# EAGLE design csa_extender_v1.0a (EAGLE 6.4)
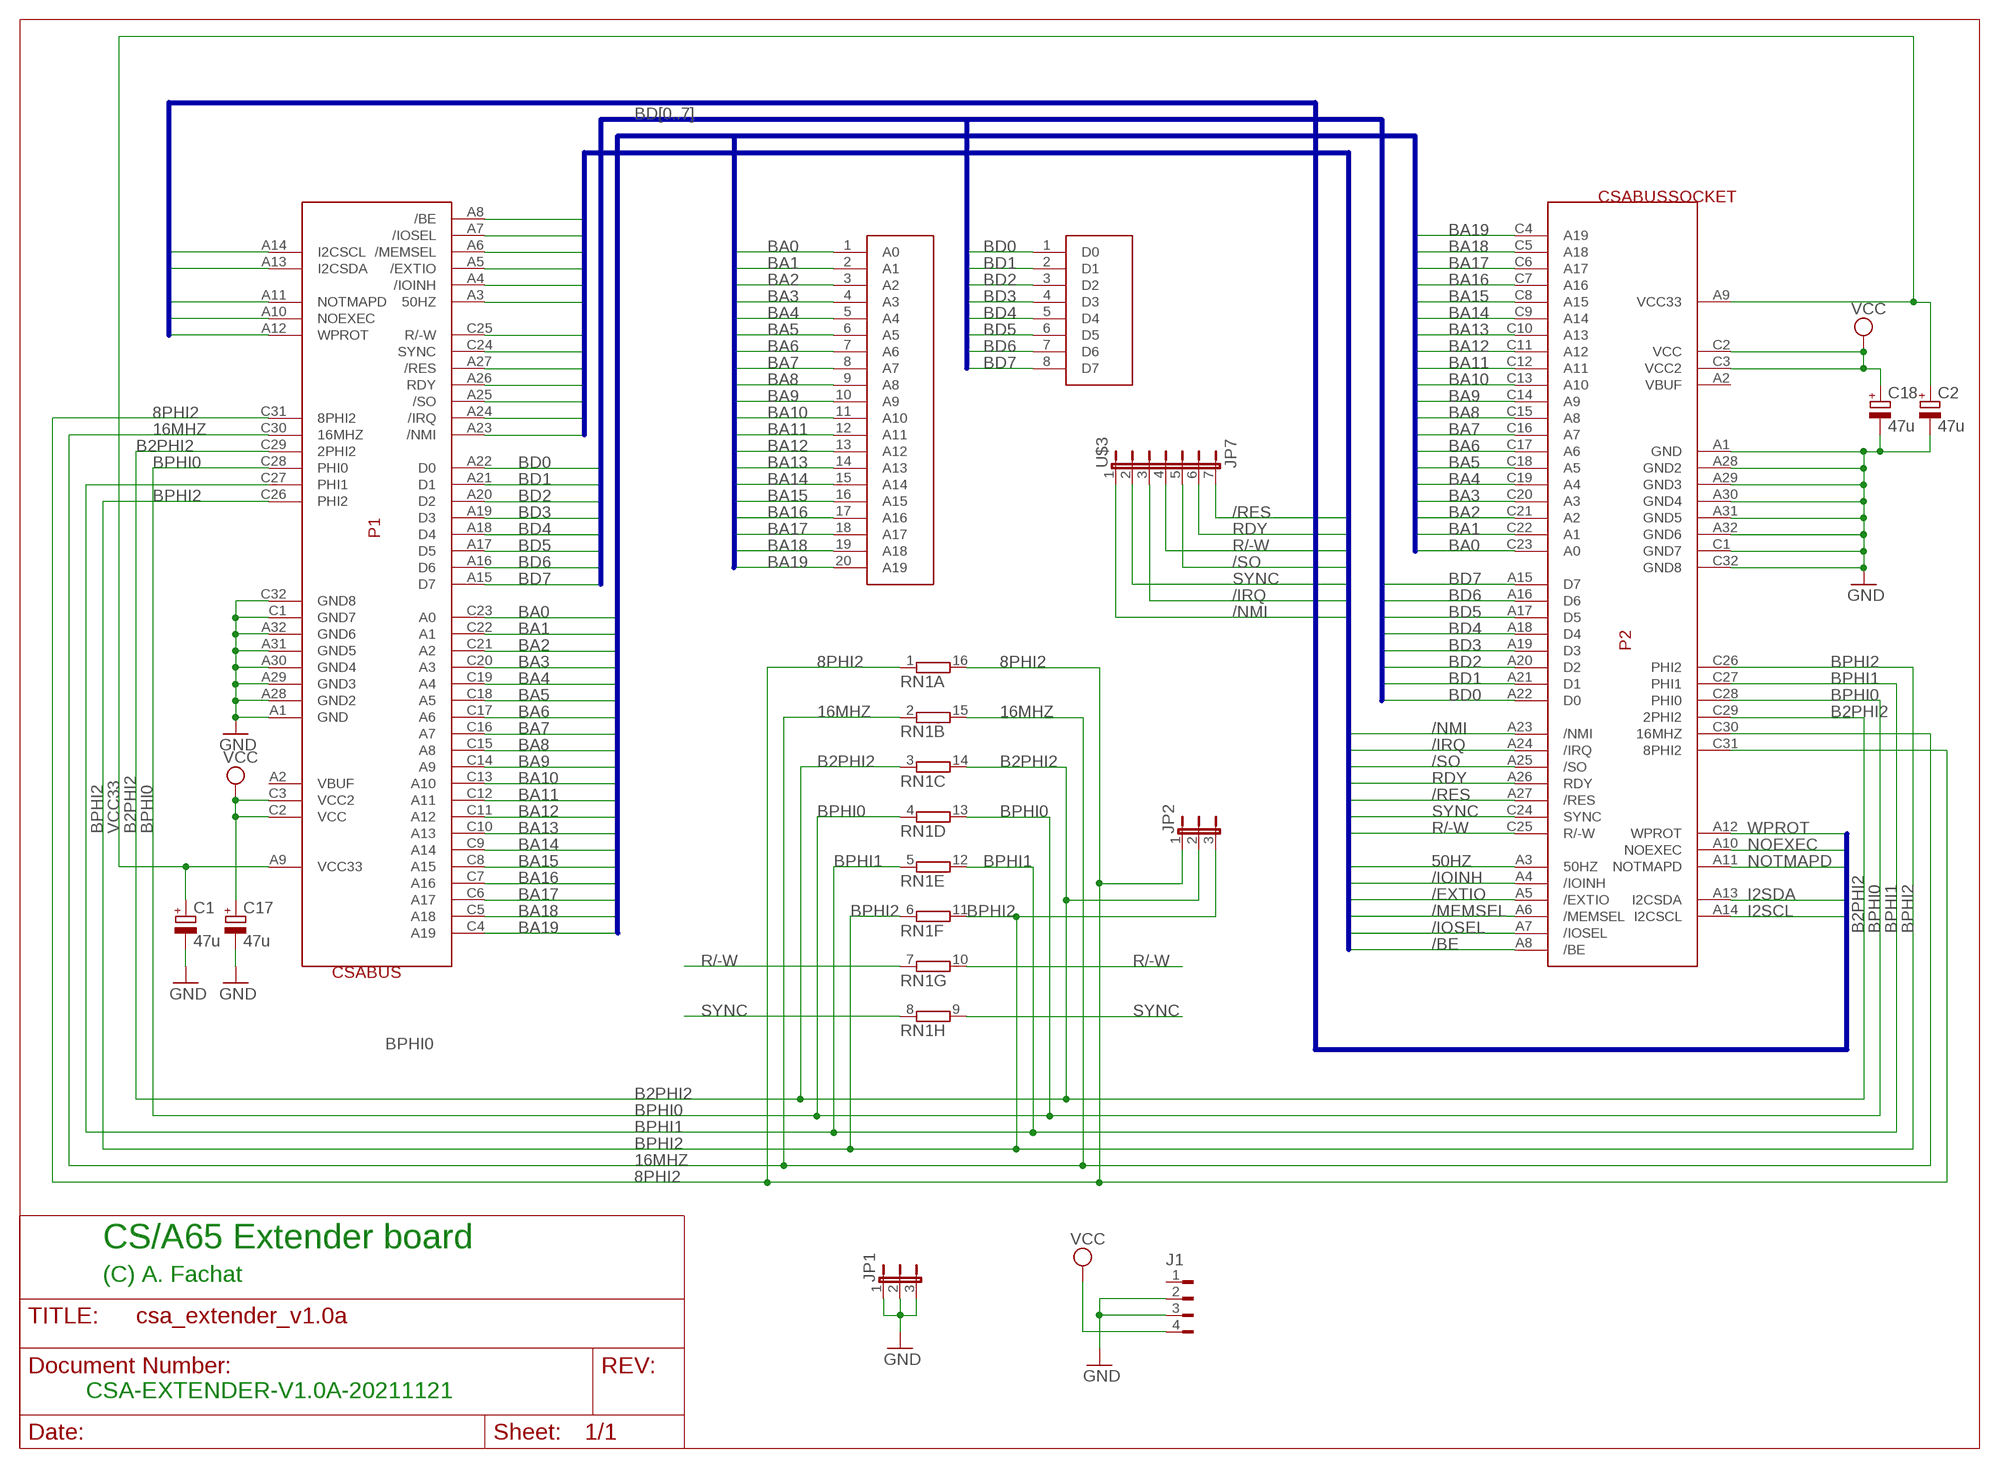
[diagram p0: schematic, sheet 1]

## Parts
C1  47u  CPOL-EUE2.5-5  [E2,5-5]
C2  47u  CPOL-EUE2.5-5  [E2,5-5]
C17  47u  CPOL-EUE2.5-5  [E2,5-5]
C18  47u  CPOL-EUE2.5-5  [E2,5-5]
J1  FLOP-4W827001  [827001]
JP1  JP2E  [JP2]
JP2  JP2E  [JP2]
P1  CSABUS  [CSABUS]
P2  CSABUSSOCKET  [CSABUSSOCK]
RN1  8R-N  [DIL16]
U$1  JA0-19  [A0-19]
U$2  JD0-7  [D0-7]
U$3  JP7  [JP7]

## Nets
8PHI2: JP2.1 P1.C31(8PHI2) P2.C31(8PHI2) RN1.1 RN1.16
16MHZ: P1.C30(16MHZ) P2.C30(16MHZ) RN1.2 RN1.15
50HZ: P1.A3(50HZ) P2.A3(50HZ)
/BE: P1.A8(/BE) P2.A8(/BE)
/EXTIO: P1.A5(/EXTIO) P2.A5(/EXTIO)
/IOINH: P1.A4(/IOINH) P2.A4(/IOINH)
/IOSEL: P1.A7(/IOSEL) P2.A7(/IOSEL)
/IRQ: P1.A24(/IRQ) P2.A24(/IRQ) U$3.3
/MEMSEL: P1.A6(/MEMSEL) P2.A6(/MEMSEL)
/NMI: P1.A23(/NMI) P2.A23(/NMI) U$3.1
/RES: P1.A27(/RES) P2.A27(/RES) U$3.7
/SO: P1.A25(/SO) P2.A25(/SO) U$3.5
B2PHI2: JP2.2 P1.C29(2PHI2) P2.C29(2PHI2) RN1.3 RN1.14
BA0: P1.C23(A0) P2.C23(A0) U$1.1(A0)
BA1: P1.C22(A1) P2.C22(A1) U$1.2(A1)
BA2: P1.C21(A2) P2.C21(A2) U$1.3(A2)
BA3: P1.C20(A3) P2.C20(A3) U$1.4(A3)
BA4: P1.C19(A4) P2.C19(A4) U$1.5(A4)
BA5: P1.C18(A5) P2.C18(A5) U$1.6(A5)
BA6: P1.C17(A6) P2.C17(A6) U$1.7(A6)
BA7: P1.C16(A7) P2.C16(A7) U$1.8(A7)
BA8: P1.C15(A8) P2.C15(A8) U$1.9(A8)
BA9: P1.C14(A9) P2.C14(A9) U$1.10(A9)
BA10: P1.C13(A10) P2.C13(A10) U$1.11(A10)
BA11: P1.C12(A11) P2.C12(A11) U$1.12(A11)
BA12: P1.C11(A12) P2.C11(A12) U$1.13(A12)
BA13: P1.C10(A13) P2.C10(A13) U$1.14(A13)
BA14: P1.C9(A14) P2.C9(A14) U$1.15(A14)
BA15: P1.C8(A15) P2.C8(A15) U$1.16(A15)
BA16: P1.C7(A16) P2.C7(A16) U$1.17(A16)
BA17: P1.C6(A17) P2.C6(A17) U$1.18(A17)
BA18: P1.C5(A18) P2.C5(A18) U$1.19(A18)
BA19: P1.C4(A19) P2.C4(A19) U$1.20(A19)
BD0: P1.A22(D0) P2.A22(D0) U$2.1(D0)
BD1: P1.A21(D1) P2.A21(D1) U$2.2(D1)
BD2: P1.A20(D2) P2.A20(D2) U$2.3(D2)
BD3: P1.A19(D3) P2.A19(D3) U$2.4(D3)
BD4: P1.A18(D4) P2.A18(D4) U$2.5(D4)
BD5: P1.A17(D5) P2.A17(D5) U$2.6(D5)
BD6: P1.A16(D6) P2.A16(D6) U$2.7(D6)
BD7: P1.A15(D7) P2.A15(D7) U$2.8(D7)
BPHI0: P1.C28(PHI0) P2.C28(PHI0) RN1.4 RN1.13
BPHI1: P1.C27(PHI1) P2.C27(PHI1) RN1.5 RN1.12
BPHI2: JP2.3 P1.C26(PHI2) P2.C26(PHI2) RN1.6 RN1.11
GND: C1.- C2.- C17.- C18.- J1.2 J1.3 JP1.1 JP1.2 JP1.3 P1.A1(GND) P1.A28(GND2) P1.A29(GND3) P1.A30(GND4) P1.A31(GND5) P1.A32(GND6) P1.C1(GND7) P1.C32(GND8) P2.A1(GND) P2.A28(GND2) P2.A29(GND3) P2.A30(GND4) P2.A31(GND5) P2.A32(GND6) P2.C1(GND7) P2.C32(GND8)
I2SCL: P1.A14(I2CSCL) P2.A14(I2CSCL)
I2SDA: P1.A13(I2CSDA) P2.A13(I2CSDA)
NOEXEC: P1.A10(NOEXEC) P2.A10(NOEXEC)
NOTMAPD: P1.A11(NOTMAPD) P2.A11(NOTMAPD)
R/-W: P1.C25(R/-W) P2.C25(R/-W) RN1.7 RN1.10 U$3.4
RDY: P1.A26(RDY) P2.A26(RDY) U$3.6
SYNC: P1.C24(SYNC) P2.C24(SYNC) RN1.8 RN1.9 U$3.2
VCC: C17.+ C18.+ J1.4 P1.C2(VCC) P1.C3(VCC2) P2.C2(VCC) P2.C3(VCC2)
VCC33: C1.+ C2.+ P1.A9(VCC33) P2.A9(VCC33)
WPROT: P1.A12(WPROT) P2.A12(WPROT)
Unconnected: J1.1 P1.A2(VBUF) P2.A2(VBUF)

## Buses
BD[0..7]
BA[0..19]
/BE,/IOSEL,/MEMSEL,/EXTIO,/IOINH,50HZ,R/-W,SYNC,/RES,RDY,/SO,/IRQ,/NMI
I2SCL,I2SDA,NOTMAPD,NOEXEC,WPROT

## Notes on the sheet
- CS/A65 Extender board
- (C) A. Fachat
- CSA-EXTENDER-V1.0A-20211121

## Library data of the parts
C1 C2 C17 C18 = rcl:CPOL-EU: POLARIZED CAPACITOR, European symbol
J1 = con-amp:FLOP-4W: MATE N-LOCK Floppy / HDD conector Distributor: Bürklin 71F972
JP1 JP2 = jumper:JP2E: JUMPER
P1 P2 = csa:CSABUS
RN1 = resistor-dil:8R-N: DIL RESISTOR; OC_FARNELL: unknown; OC_NEWARK: unknown
U$1 = csa:JA0-19
U$2 = csa:JD0-7
U$3 = csa:JP7

## Board
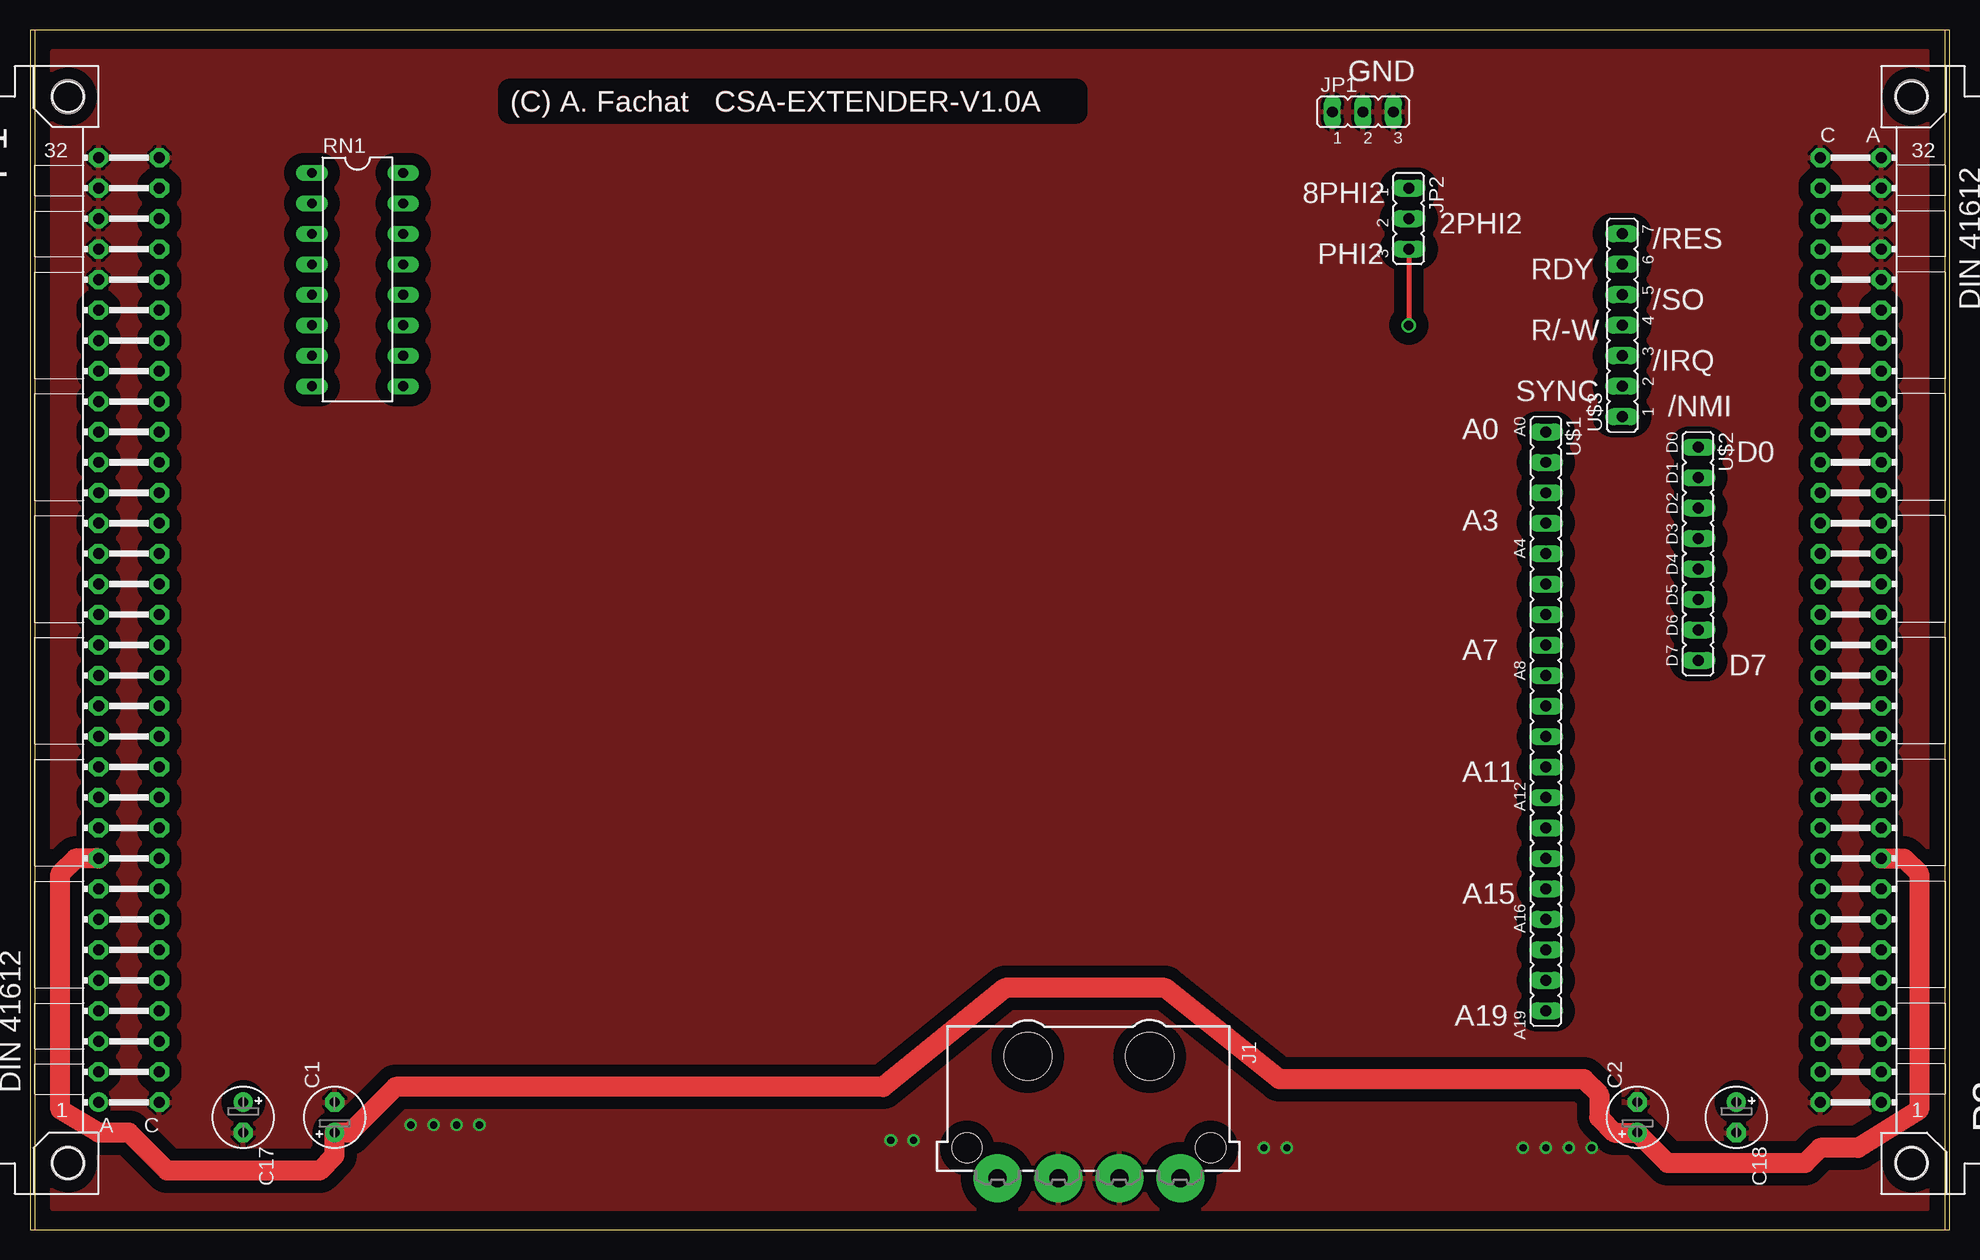
[diagram p1: board, top side]
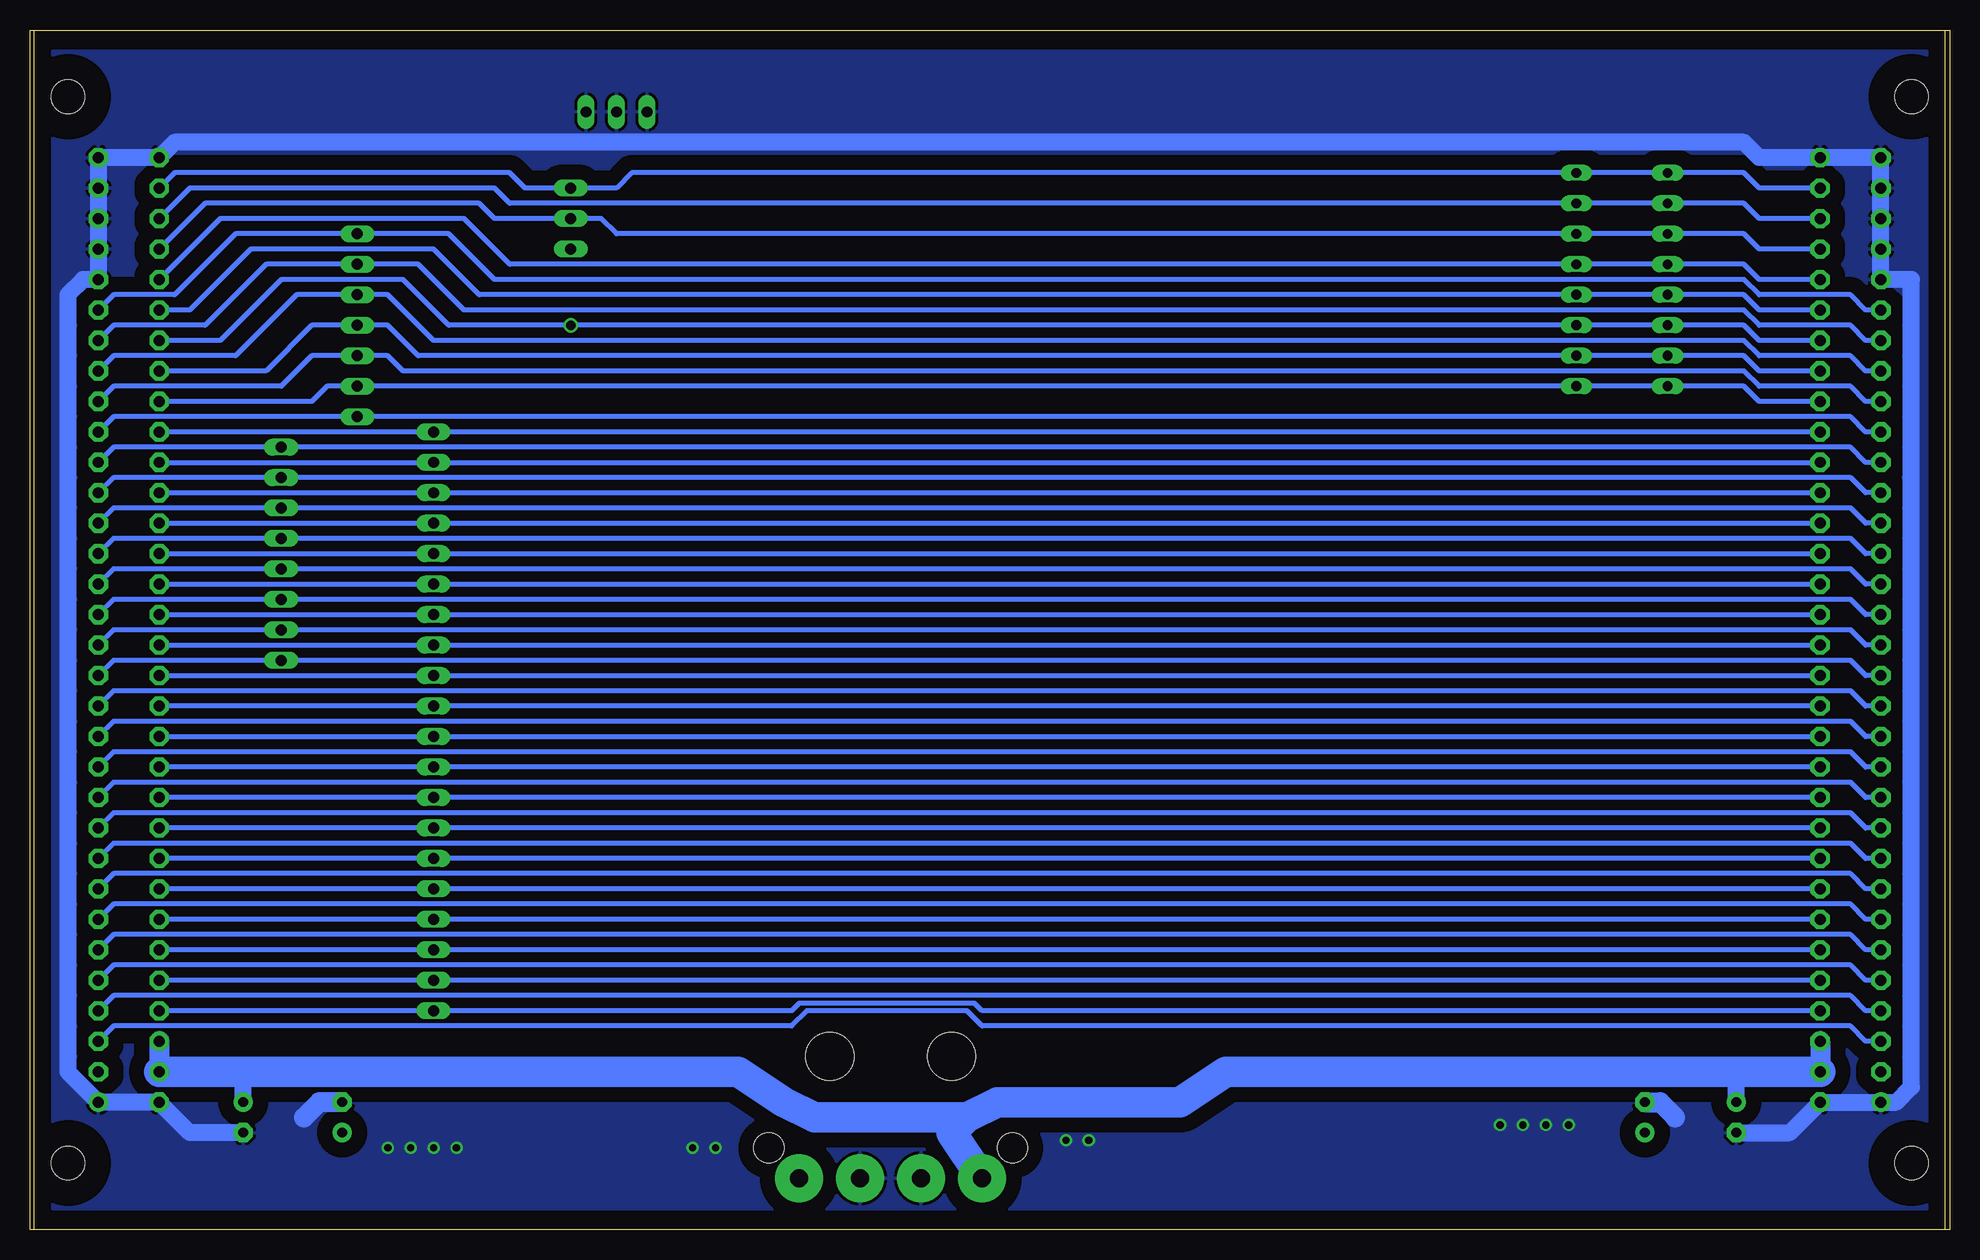
[diagram p2: board, bottom side, seen from below]

Size 160 x 100.03 mm. Coordinates in mm from the lower left corner, seen from the top.
Outline: 0,0.01 160,0.01 160,100.01 0,100.01 0,0.01
Copper layers (1*16): Top 0.035mm / dielectric 1.5mm / Bottom 0.035mm
Design rules "default *": minimum track width 10mil, minimum drill 20mil, track to track 8mil, track to pad 8mil, pad to pad 8mil, via to via 8mil, smd to smd 8mil, copper to edge 40mil, drill to drill 8mil, minimum pad ring 10mil, minimum via ring 8mil, stop-mask expansion 4mil, vias tented up to drill 0mil, thermal gap 10mil

### Footprints (pad centres in the part's own frame; a part is rotated, then mirrored left to right if it is on the bottom)
E2,5-5 = drill 0.813 pad 1.6: + -1.27,0 | drill 0.813 pad 1.6 octagon: - 1.27,0
827001 = drill 1.5 pad 4: 1 -7.62,0; 2 -2.54,0; 3 2.54,0; 4 7.62,0 | hole 4: 5.08,-10.16; -5.08,-10.16 | hole 2.5: 10.16,-2.54; -10.16,-2.54
JP2 = drill 0.914 long: 1 -2.54,0; 2 0,0; 3 2.54,0
CSABUS = drill 0.914 pad 1.6: A1 7.62,36.83 | drill 0.914 pad 1.6 octagon: A2 7.62,34.29; A3 7.62,31.75; A4 7.62,29.21; A5 7.62,26.67; A6 7.62,24.13; A7 7.62,21.59; A8 7.62,19.05; A9 7.62,16.51; A10 7.62,13.97; A11 7.62,11.43; A12 7.62,8.89; A13 7.62,6.35; A14 7.62,3.81; A15 7.62,1.27; A16 7.62,-1.27; A17 7.62,-3.81; A18 7.62,-6.35; A19 7.62,-8.89; A20 7.62,-11.43; A21 7.62,-13.97; A22 7.62,-16.51; A23 7.62,-19.05; A24 7.62,-21.59; A25 7.62,-24.13; A26 7.62,-26.67; A27 7.62,-29.21; A28 7.62,-31.75; A29 7.62,-34.29; A30 7.62,-36.83; A31 7.62,-39.37; A32 7.62,-41.91; C1 2.54,36.83; C2 2.54,34.29; C3 2.54,31.75; C4 2.54,29.21; C5 2.54,26.67; C6 2.54,24.13; C7 2.54,21.59; C8 2.54,19.05; C9 2.54,16.51; C10 2.54,13.97; C11 2.54,11.43; C12 2.54,8.89; C13 2.54,6.35; C14 2.54,3.81; C15 2.54,1.27; C16 2.54,-1.27; C17 2.54,-3.81; C18 2.54,-6.35; C19 2.54,-8.89; C20 2.54,-11.43; C21 2.54,-13.97; C22 2.54,-16.51; C23 2.54,-19.05; C24 2.54,-21.59; C25 2.54,-24.13; C26 2.54,-26.67; C27 2.54,-29.21; C28 2.54,-31.75; C29 2.54,-34.29; C30 2.54,-36.83; C31 2.54,-39.37; C32 2.54,-41.91 | hole 2.794: 10.16,41.91; 10.16,-46.99
CSABUSSOCK = drill 0.914 pad 1.6: A1 -7.62,-39.37 | drill 0.914 pad 1.6 octagon: A2 -7.62,-36.83; A3 -7.62,-34.29; A4 -7.62,-31.75; A5 -7.62,-29.21; A6 -7.62,-26.67; A7 -7.62,-24.13; A8 -7.62,-21.59; A9 -7.62,-19.05; A10 -7.62,-16.51; A11 -7.62,-13.97; A12 -7.62,-11.43; A13 -7.62,-8.89; A14 -7.62,-6.35; A15 -7.62,-3.81; A16 -7.62,-1.27; A17 -7.62,1.27; A18 -7.62,3.81; A19 -7.62,6.35; A20 -7.62,8.89; A21 -7.62,11.43; A22 -7.62,13.97; A23 -7.62,16.51; A24 -7.62,19.05; A25 -7.62,21.59; A26 -7.62,24.13; A27 -7.62,26.67; A28 -7.62,29.21; A29 -7.62,31.75; A30 -7.62,34.29; A31 -7.62,36.83; A32 -7.62,39.37; C1 -12.7,-39.37; C2 -12.7,-36.83; C3 -12.7,-34.29; C4 -12.7,-31.75; C5 -12.7,-29.21; C6 -12.7,-26.67; C7 -12.7,-24.13; C8 -12.7,-21.59; C9 -12.7,-19.05; C10 -12.7,-16.51; C11 -12.7,-13.97; C12 -12.7,-11.43; C13 -12.7,-8.89; C14 -12.7,-6.35; C15 -12.7,-3.81; C16 -12.7,-1.27; C17 -12.7,1.27; C18 -12.7,3.81; C19 -12.7,6.35; C20 -12.7,8.89; C21 -12.7,11.43; C22 -12.7,13.97; C23 -12.7,16.51; C24 -12.7,19.05; C25 -12.7,21.59; C26 -12.7,24.13; C27 -12.7,26.67; C28 -12.7,29.21; C29 -12.7,31.75; C30 -12.7,34.29; C31 -12.7,36.83; C32 -12.7,39.37 | hole 2.794: -5.08,44.45; -5.08,-44.45
DIL16 = drill 0.813 long: 1 -8.89,-3.81; 2 -6.35,-3.81; 3 -3.81,-3.81; 4 -1.27,-3.81; 5 1.27,-3.81; 6 3.81,-3.81; 7 6.35,-3.81; 8 8.89,-3.81; 9 8.89,3.81; 10 6.35,3.81; 11 3.81,3.81; 12 1.27,3.81; 13 -1.27,3.81; 14 -3.81,3.81; 15 -6.35,3.81; 16 -8.89,3.81
A0-19 = drill 0.914 long: 1 -8.89,0; 2 -6.35,0; 3 -3.81,0; 4 -1.27,0; 5 1.27,0; 6 3.81,0; 7 6.35,0; 8 8.89,0; 9 11.43,0; 10 13.97,0; 11 16.51,0; 12 19.05,0; 13 21.59,0; 14 24.13,0; 15 26.67,0; 16 29.21,0; 17 31.75,0; 18 34.29,0; 19 36.83,0; 20 39.37,0
D0-7 = drill 0.914 long: 1 0,0; 2 2.54,0; 3 5.08,0; 4 7.62,0; 5 10.16,0; 6 12.7,0; 7 15.24,0; 8 17.78,0
JP7 = drill 0.914 long: 1 0,0; 2 2.54,0; 3 5.08,0; 4 7.62,0; 5 10.16,0; 6 12.7,0; 7 15.24,0

### Placement (x,y rotation side)
C1  25.39,9.37 90 top
C2  133.98,9.37 90 top
C17  17.77,9.37 270 top
C18  142.23,9.37 270 top
J1  88.26,4.29 180 top
JP1  111.12,93.19 0 top
JP2  114.93,84.3 270 top
P1  13.33,47.47 180 top
P2  161.92,50.01 0 top
RN1  27.3,79.22 270 top
U$1  126.36,57.63 270 top
U$2  139.06,65.25 270 top
U$3  132.71,67.79 90 top

### Tracks (layer width: path | path; a pad name or v marks a point on that pad's centre or on a via)
8PHI2
  Bottom 0.406: P1.C31 15.87,86.84 17.14,88.11 RN1.1 RN1.16 109.85,88.11 111.12,86.84 JP2.1 118.74,86.84 120.01,88.11 147.95,88.11 P2.C31
16MHZ
  Bottom 0.406: P1.C30 15.87,84.3 17.14,85.57 RN1.2 RN1.15 120.01,85.57 121.28,86.84 146.68,86.84 P2.C30
50HZ
  Bottom 0.406: P1.A3 6.98,15.72 8.25,16.99 80.64,16.99 81.91,18.26 95.24,18.26 96.52,16.99 153.03,16.99 P2.A3
/BE
  Bottom 0.406: P1.A8 6.98,28.42 8.25,29.69 153.03,29.69 P2.A8
/EXTIO
  Bottom 0.406: P1.A5 6.98,20.8 8.25,22.07 153.03,22.07 P2.A5
/IOINH
  Bottom 0.406: P1.A4 6.98,18.26 8.25,19.53 153.03,19.53 P2.A4
/IOSEL
  Bottom 0.406: P1.A7 6.98,25.88 8.25,27.15 153.03,27.15 P2.A7
/IRQ
  Bottom 0.406: P1.A24 6.98,69.06 8.25,70.33 15.87,70.33 17.14,71.6 128.9,71.6 130.17,72.87 U$3.3 136.52,72.87 139.06,70.33 153.03,70.33 P2.A24
/MEMSEL
  Bottom 0.406: P1.A6 6.98,23.34 8.25,24.61 153.03,24.61 P2.A6
/NMI
  Bottom 0.406: P1.A23 6.98,66.52 8.25,67.79 U$3.1 153.03,67.79 P2.A23
/RES
  Bottom 0.406: P1.A27 6.98,76.68 8.25,77.95 15.87,77.95 17.14,79.22 121.28,79.22 125.09,83.03 U$3.7 142.87,83.03 147.95,77.95 153.03,77.95 P2.A27
/SO
  Bottom 0.406: P1.A25 6.98,71.6 8.25,72.87 15.87,72.87 17.14,74.14 126.36,74.14 130.17,77.95 U$3.5 137.79,77.95 142.87,72.87 153.03,72.87 P2.A25
B2PHI2
  Bottom 0.406: P1.C29 15.87,81.76 17.14,83.03 RN1.3 RN1.14 | 32.38,83.03 RN1.14 | RN1.14 111.12,83.03 112.39,84.3 JP2.2 121.28,84.3 122.55,85.57 145.41,85.57 P2.C29
BA0
  Bottom 0.406: P1.C23 U$1.1 P2.C23
BA1
  Bottom 0.406: P2.C22 U$1.2 P1.C22
BA2
  Bottom 0.406: P2.C21 U$1.3 P1.C21
BA3
  Bottom 0.406: P2.C20 U$1.4 P1.C20
BA4
  Bottom 0.406: P2.C19 U$1.5 P1.C19
BA5
  Bottom 0.406: P2.C18 U$1.6 P1.C18
BA6
  Bottom 0.406: P2.C17 U$1.7 P1.C17
BA7
  Bottom 0.406: P2.C16 U$1.8 P1.C16
BA8
  Bottom 0.406: P2.C15 U$1.9 P1.C15
BA9
  Bottom 0.406: P1.C14 U$1.10 P2.C14
BA10
  Bottom 0.406: P2.C13 U$1.11 P1.C13
BA11
  Bottom 0.406: P1.C12 U$1.12 P2.C12
BA12
  Bottom 0.406: P1.C11 U$1.13 P2.C11
BA13
  Bottom 0.406: P1.C10 U$1.14 P2.C10
BA14
  Bottom 0.406: P1.C9 U$1.15 P2.C9
BA15
  Bottom 0.406: P1.C8 U$1.16 P2.C8
BA16
  Bottom 0.406: P1.C7 U$1.17 P2.C7
BA17
  Bottom 0.406: P1.C6 U$1.18 P2.C6
BA18
  Bottom 0.406: P1.C5 U$1.19 P2.C5
BA19
  Bottom 0.406: P1.C4 80.64,18.26 81.27,18.9 95.88,18.9 96.52,18.26 U$1.20 P2.C4
BD0
  Bottom 0.406: P1.A22 6.98,63.98 8.25,65.25 U$2.1 153.03,65.25 P2.A22
BD1
  Bottom 0.406: P1.A21 6.98,61.44 8.25,62.71 U$2.2 153.03,62.71 P2.A21
BD2
  Bottom 0.406: P1.A20 6.98,58.9 8.25,60.17 U$2.3 153.03,60.17 P2.A20
BD3
  Bottom 0.406: P1.A19 6.98,56.36 8.25,57.63 U$2.4 153.03,57.63 P2.A19
BD4
  Bottom 0.406: P1.A18 6.98,53.82 8.25,55.09 U$2.5 153.03,55.09 P2.A18
BD5
  Bottom 0.406: P1.A17 6.98,51.28 8.25,52.55 U$2.6 153.03,52.55 P2.A17
BD6
  Bottom 0.406: P1.A16 6.98,48.74 8.25,50.01 U$2.7 153.03,50.01 P2.A16
BD7
  Bottom 0.406: P1.A15 6.98,46.2 8.25,47.47 U$2.8 153.03,47.47 P2.A15
BPHI0
  Bottom 0.406: P1.C28 15.87,79.22 17.14,80.49 RN1.4 RN1.13 120.01,80.49 123.82,84.3 144.14,84.3 P2.C28
BPHI1
  Bottom 0.406: P1.C27 15.87,76.68 17.14,77.95 RN1.5 RN1.12 122.55,77.95 126.36,81.76 141.6,81.76 146.68,76.68 P2.C27
BPHI2  (via drill 0.8)
  Top 0.406: JP2.3 v114.93,75.41
  Bottom 0.406: P1.C26 15.87,74.14 17.14,75.41 RN1.6 RN1.11 v114.93,75.41 125.09,75.41 128.9,79.22 139.06,79.22 144.14,74.14 P2.C26
GND  (via drill 0.6)
  Bottom 1.422: C18.- 146.68,8.1 P2.C1 P2.A1 156.84,13.18 156.84,77.95 155.57,79.22 P2.A28 P2.A29 P2.A30 P2.A31 P2.A32 P2.C32 147.95,90.65 17.14,90.65 15.87,89.38 P1.C32 P1.A32 P1.A31 P1.A30 P1.A29 P1.A28 3.17,79.22 3.17,11.91 4.44,10.64 P1.A1 P1.C1 13.33,8.1 C17.-
  Bottom 1.676: C2.- 135.88,10.64 137.16,9.37 | C1.- 24.12,10.64 22.86,9.37
  other vias: 31.74,8.74 33.65,8.74 35.55,8.74 37.46,8.74 73.66,7.47 71.75,7.47 102.86,6.83 104.77,6.83 130.17,6.83 128.27,6.83 126.36,6.83 124.45,6.83
  pour Bottom (isolate 1.27): 1.9,98.27 158.11,98.27 158.11,1.75 1.9,1.75
  pour Top (isolate 1.016): 1.9,98.27 158.11,98.27 158.11,61.44 158.11,1.75 1.9,1.75 1.9,11.91
I2SCL
  Bottom 0.406: P1.A14 6.98,43.66 8.25,44.93 153.03,44.93 P2.A14
I2SDA
  Bottom 0.406: P1.A13 6.98,41.12 8.25,42.39 153.03,42.39 P2.A13
NOEXEC
  Bottom 0.406: P1.A10 6.98,33.5 8.25,34.77 153.03,34.77 P2.A10
NOTMAPD
  Bottom 0.406: P1.A11 6.98,36.04 8.25,37.31 153.03,37.31 P2.A11
R/-W
  Bottom 0.406: P1.C25 15.87,71.6 17.14,72.87 RN1.7 RN1.10 127.63,72.87 130.17,75.41 U$3.4 136.52,75.41 140.33,71.6 P2.C25
RDY
  Bottom 0.406: P1.A26 6.98,74.14 8.25,75.41 15.87,75.41 17.14,76.68 123.82,76.68 127.63,80.49 U$3.6 140.33,80.49 145.41,75.41 153.03,75.41 P2.A26
SYNC
  Bottom 0.406: P1.C24 15.87,69.06 17.14,70.33 RN1.8 RN1.9 U$3.2 135.25,70.33 136.52,69.06 P2.C24
VCC
  Bottom 1.422: C17.+ 17.77,13.18 | C18.+ 142.23,13.18
  Bottom 1.676: P1.C3 P1.C2 | P2.C3 P2.C2
  Bottom 2.54: P1.C2 17.77,13.18 60.32,13.18 64.13,10.64 79.37,10.64 81.91,9.37 | P2.C2 142.23,13.18 100.96,13.18 97.15,10.64 94.61,9.37 81.91,9.37 | J1.4 83.18,8.1 81.91,9.37
VCC33
  Top 1.676: P2.A9 156.2,30.96 157.47,29.69 157.47,10.01 152.39,6.83 149.22,6.83 147.95,5.56 136.52,5.56 C2.+ 132.07,8.1 130.81,9.37 130.81,11.28 129.53,12.55 104.13,12.55 94.61,20.17 81.27,20.17 71.11,11.91 30.47,11.91 26.66,8.1 C1.+ 25.39,6.2 24.12,4.93 11.43,4.93 8.25,8.1 5.71,8.1 2.54,10.01 2.54,29.69 3.8,30.96 P1.A9
  Bottom 0.406: P1.A9 6.98,30.96 8.25,32.23 153.03,32.23 P2.A9
WPROT
  Bottom 0.406: P1.A12 6.98,38.58 8.25,39.85 153.03,39.85 P2.A12

### Text on the board
Top: (C) A. Fachat CSA-EXTENDER-V1.0A
tNames: GND | (C) A. Fachat CSA-EXTENDER-V1.0A | 8PHI2 | 2PHI2 | /RES | PHI2 | RDY | /SO | R/-W | /IRQ | SYNC | /NMI | A0 | D0 | A3 | A7 | D7 | A11 | A15 | A19